# Altium project Node.PrjPcb
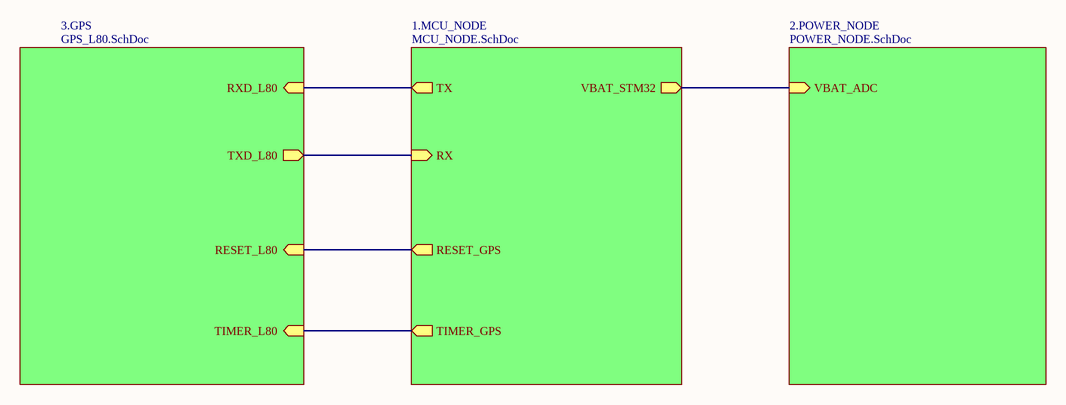
[diagram p0: Node.SchDoc]
4 sheets, 79 parts. Net scope: hierarchical (ports join the sheet entries above them; power ports are global).
Board file: NODE.PcbDoc
Sheets:
  Node.SchDoc
    1.MCU_NODE = MCU_NODE.SchDoc
    2.POWER_NODE = POWER_NODE.SchDoc
    3.GPS = GPS_L80.SchDoc

## Sheet Node.SchDoc
size A

### Sub-sheets
1.MCU_NODE = MCU_NODE.SchDoc: TX (out), VBAT_STM32 (out), RX (in), RESET_GPS (out), TIMER_GPS (out)
2.POWER_NODE = POWER_NODE.SchDoc: VBAT_ADC (in)
3.GPS = GPS_L80.SchDoc: RXD_L80 (in), TXD_L80 (out), RESET_L80 (in), TIMER_L80 (in)

### Nets
NetC23_2: sheet 1.MCU_NODE/VBAT_STM32, sheet 2.POWER_NODE/VBAT_ADC
NetR19_2: sheet 1.MCU_NODE/RESET_GPS, sheet 3.GPS/RESET_L80
NetU1_12: sheet 1.MCU_NODE/TX, sheet 3.GPS/RXD_L80
NetU1_13: sheet 1.MCU_NODE/RX, sheet 3.GPS/TXD_L80
NetU1_17: sheet 1.MCU_NODE/TIMER_GPS, sheet 3.GPS/TIMER_L80

## Sheet MCU_NODE.SchDoc
size A
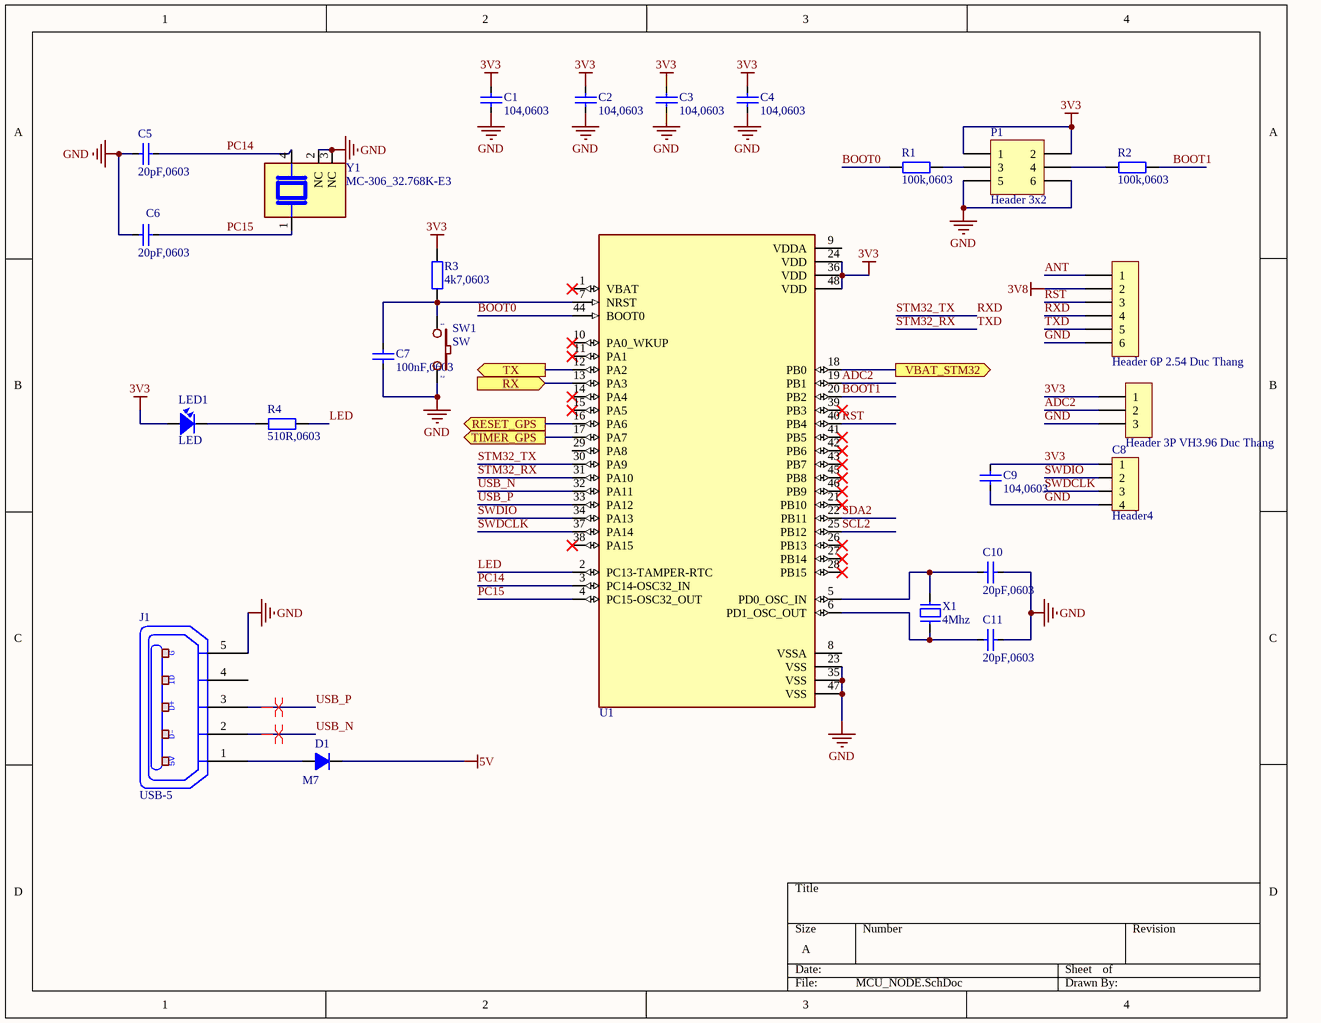
[diagram p1: MCU_NODE.SchDoc]

### Parts
C1  104,0603  [CAP_0603]
C2  104,0603  [CAP_0603]
C3  104,0603  [CAP_0603]
C4  104,0603  [CAP_0603]
C5  20pF,0603  [CAP_0603]
C6  20pF,0603  [CAP_0603]
C7  100nF,0603  [CAP_0603]
C8  Header4  [JP4-D1C]
C9  104,0603  [CAP_0603]
C10  20pF,0603  [CAP_0603]
C11  20pF,0603  [CAP_0603]
D1  M7  [SMA]
H1  Header 6P 2.54 Duc Thang  [XH2.54M-6]
H2  Header 3P VH3.96 Duc Thang  [VH3.96M-3]
J1  USB-5  [USB-M1]
LED1  LED  [LED-0805-Blue]
P1  Header 3x2  [Header 3x2]
R1  100k,0603  [RES-SMD-0603]
R2  100k,0603  [RES-SMD-0603]
R3  4k7,0603  [RES-SMD-0603]
R4  510R,0603  [RES-SMD-0603]
SW1  SW  [SW-SMD]
U1  STM32  [LQFP 48]  (value not drawn)
X1  4Mhz  [XT2]
Y1  MC-306_32.768K-E3  [XTAL_MC-306_32.768K-E3]

### Ports
RESET_GPS (out), RX (in), TIMER_GPS (out), TX (out), VBAT_STM32 (out)

### Nets
3V3: C1.2 C2.2 C3.2 C4.2 C8.1 C9.2 H2.1 LED1.1 P1.1 P1.2 R3.1 U1.24(VDD) U1.36(VDD) U1.48(VDD)
3V8: H1.2
5V: D1.2(K)
GND: C1.1 C2.1 C3.1 C4.1 C5.1 C6.1 C7.1 C8.4 C9.1 C10.2 C11.2 H1.6 H2.3 J1.5(P5) P1.5 P1.6 SW1.2 U1.23(VSS) U1.35(VSS) U1.47(VSS) Y1.2(NC) Y1.3(NC)
ADC2: H2.2 U1.19(PB1)
ANT: H1.1
BOOT0: R1.1 U1.44(BOOT0)
BOOT1: R2.2 U1.20(PB2)
LED: R4.2 U1.2(PC13-TAMPER-RTC)
PC14: C5.2 U1.3(PC14-OSC32_IN) Y1.4
PC15: C6.2 U1.4(PC15-OSC32_OUT) Y1.1
RST: H1.3 U1.40(PB4)
RXD: H1.4 U1.30(PA9)  [also labelled STM32_TX]
SCL2: U1.25(PB12)
SDA2: U1.22(PB11)
STM32_RX: H1.5 U1.31(PA10)  [also labelled TXD]
SWDCLK: C8.3 U1.37(PA14)
SWDIO: C8.2 U1.34(PA13)
USB_N: J1.2(P2) U1.32(PA11)
USB_P: J1.3(P3) U1.33(PA12)
NetC7_2: C7.2 R3.2 SW1.1 U1.7(NRST)
NetC10_1: C10.1 U1.5(PD0_OSC_IN) X1.2
NetC11_1: C11.1 U1.6(PD1_OSC_OUT) X1.1
NetC23_2: U1.18(PB0) ; port VBAT_STM32
NetD1_1: D1.1(A) J1.1(P1)
NetLED1_2: LED1.2 R4.1
NetP1_3: P1.3 R1.2
NetP1_4: P1.4 R2.1
NetR19_2: U1.16(PA6) ; port RESET_GPS
NetU1_12: U1.12(PA2) ; port TX
NetU1_13: U1.13(PA3) ; port RX
NetU1_17: U1.17(PA7) ; port TIMER_GPS

Not connected (* = marked no-connect by the designer): J1 4(P4); U1 1(VBAT)* 8(VSSA) 9(VDDA) 10(PA0_WKUP)* 11(PA1)* 14(PA4)* 15(PA5)* 21(PB10)* 26(PB13)* 27(PB14)* 28(PB15)* 29(PA8) 38(PA15)* 39(PB3)* 41(PB5)* 42(PB6)* 43(PB7)* 45(PB8)* 46(PB9)*

### Layout directives
differential pair: USB_N, USB_P

### Notes on the sheet
- (in symbol USB-5) G; ID; D+; D-; 5V

### Library data of the parts
C1-C7 C9-C11 = CapSMD: Capacitor; Value: 33p; Published: 8-Jun-2000; LatestRevisionDate: 17-Jul-2002; LatestRevisionNote: Re-released for DXP Platform.; PackageReference: RAD-0.3; Publisher: Altium Limited
C8 = Header4: Header IDC, 4 x 1 Pin Vertical 2.54mm Pitch (Non-Boxed, Male); Manufacturer: W¨¹rth Elektronik eiSos GmbH; partNo: 613002143121; ComponentLink1 Description: Manufacturer; ComponentLink2 Description: Datasheet; NoPins: 02; Created Date: 29 March 2013; ComponentLink1URL: http://www.we-online.com; ComponentLink2URL: http://katalog.we-online.de/em/datasheet/6130xx143121.pdf; Created by: Karrer Zheng
D1 = D1A: Diode 1A; Value: 1N4007
H1 = Header 6P 2.54 Duc Thang: Cắm; Ten_Linh_Kien: Header 6P XH2.54-6P Đực Thẳng; Don_Vi: Con; Ma_Hang: MH001972; Chung_Loai: Cắm
H2 = Header 3P VH3.96 Duc Thang: Cắm; Ten_Linh_Kien: Header 3P XH2.54-3P Đực Thẳng; Don_Vi: Con; Ma_Hang: MH001292; Chung_Loai: Cắm
J1 = USB-5: Manufacturer: FCI; Manufacturer Part Number: 10118193-0001LF; Connector Type: USB - micro B; Number of Contacts: 5; Gender: Receptacle; Specifications: USB 2.0; .Creator: MM; .Checked PCB: RF; Supplier 1: Digi-Key; RoHS: RoHS Compliant; Category: Connectors, Interconnects; Stock 1: 28642; Pricing 1: 1=0.46, 10=0.433, 25=0.3712, 50=0.3156, 100=0.3032, 250=0.27224, 500=0.25988 (USD); Packaging: Cut Tape (CT); Mounting Type: Surface Mount, Right Angle, Horizontal; Features: Shielded, Solder Retention; Ingress Protection: -; ComponentLink1URL: http://portal.fciconnect.com/Comergent//fci/drawing/10118193.pdf; ComponentLink1Description: http://portal.fciconnect.com/Comergent//fci/drawing/10118193.pdf; Supplier Part Number 1: 609-4616-1-ND; .Checked SCH: MM
LED1 = LED: LED Single colour Green and Red; Value: LED 3 ly Single Colour
P1 = Header 3x2: Header, 6-Pin, 2-Row; LatestRevisionDate: 17-Jul-2002; LatestRevisionNote: Re-released for DXP Platform.; Publisher: Altium Limited
R1-R4 = Resistor - SMD: Resistor SMD; Manufacturer: Generic Components; Class: Passive; Published: 08/06/2000; Publisher: Altium Hobart Technology Centre
SW1 = SW2: Switch button 2 pin; Value: SW chip 2 pin
U1 = STM32F103C8T6: STM32 ARM-based 32-bit MCU with 64 Kbytes Flash, 64-pin LQFP, Industrial Temperature
X1 = XT2: Crystal For all Crystal 2pin.; Value: 4Mhz
Y1 = MC-306_32.768K-E3: CRYSTAL 32.7680KHZ 6PF SMD; MF: EPSON; MP: MC-306 32.768K-E3; Check_prices: https://www.snapeda.com/parts/MC-306%2032.768K-E3/EPSON/view-part/?ref=eda; Package: NON STANDARD-4 EPSON; Value: *; Price: None; Purchase-URL: https://pricing.snapeda.com/search/part/MC-306 32.768K-E3/?ref=eda; SnapEDA_Link: https://www.snapeda.com/parts/MC-306%2032.768K-E3/EPSON/view-part/?ref=snap; Availability: In Stock

## Sheet POWER_NODE.SchDoc
size A
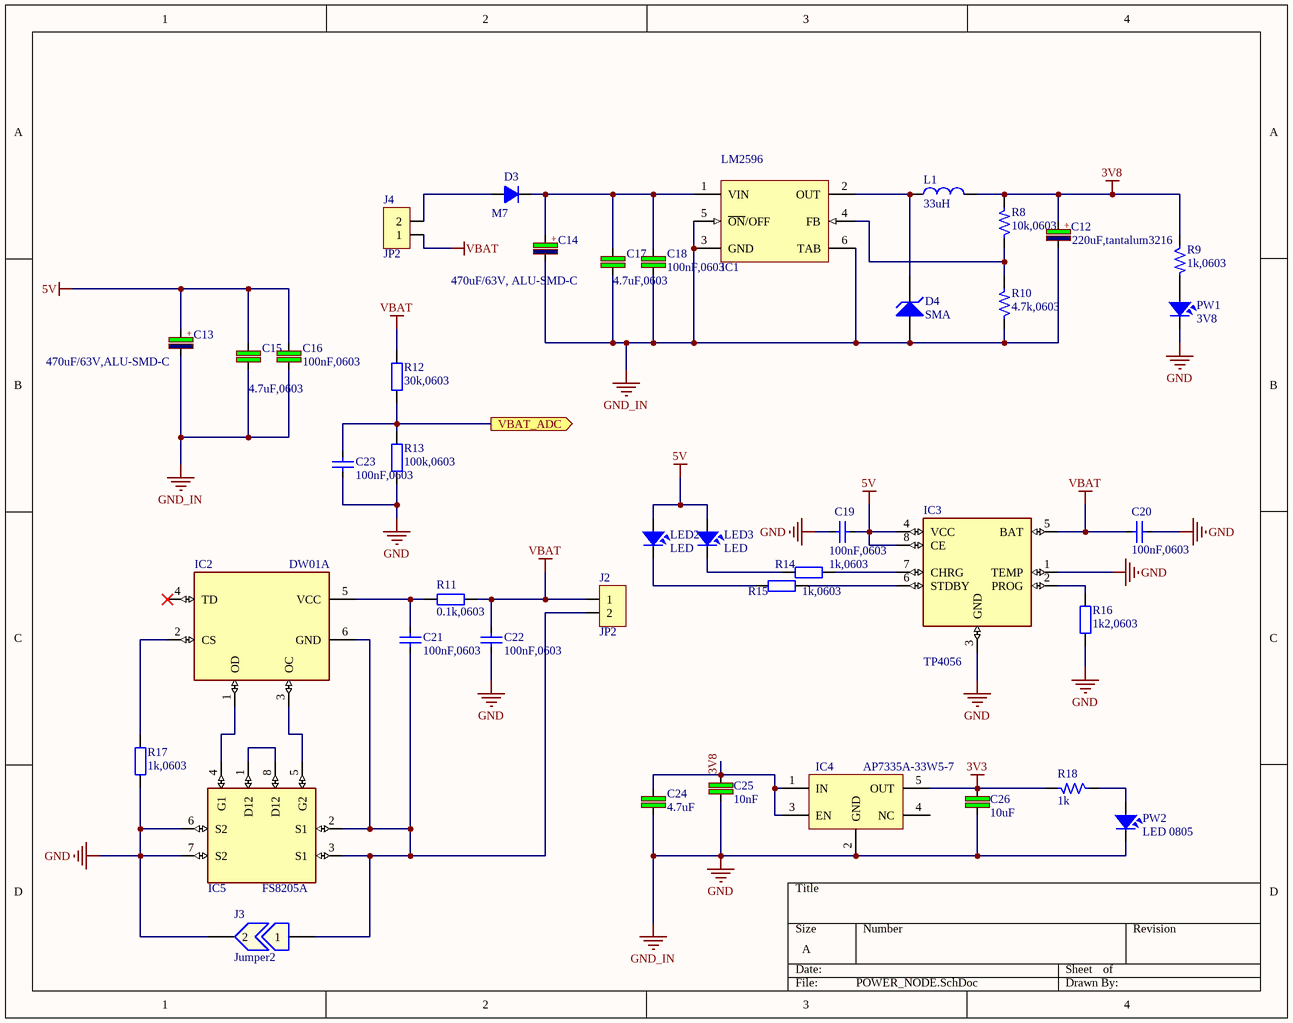
[diagram p2: POWER_NODE.SchDoc]

### Parts
C12  value 220uF,tantalum3216  [CAP_TANTALUM_3216]  (hidden comment: 220uF)
C13  470uF/63V,ALU-SMD-C  [CAP-ALU-SMD-C]
C14  470uF/63V, ALU-SMD-C  [CAP-ALU-SMD-C]
C15  value 4.7uF,0603  [CAP_0603]  (hidden comment: 4.7uF)
C16  value 100nF,0603  [CAP_0603]  (hidden comment: 4.7uF)
C17  value 4.7uF,0603  [CAP_0603]  (hidden comment: 4.7uF)
C18  value 100nF,0603  [CAP_0603]  (hidden comment: 4.7uF)
C19  100nF,0603  [CAP_0603]
C20  100nF,0603  [CAP_0603]
C21  100nF,0603  [CAP_0603]
C22  100nF,0603  [CAP_0603]
C23  100nF,0603  [CAP_0603]
C24  4.7uF  [CAP_0603]
C25  10nF  [CAP_0603]
C26  10uF  [CAP_0603]
D3  M7  [SMA]
D4  SMA  [SMA]
IC1  LM2596  [TO-263]
IC2  DW01A  [SOT23-6]
IC3  TP4056  [TP4056]
IC4  AP7335A-33W5-7  [SOT23-5]
IC5  FS8205A  [FS8205A]
J2  JP2  [KF2-5.08]
J3  Jumper2  [JUMPER2]
J4  JP2  [KF2-5.08]
L1  33uH  [Inductor_SMD]
LED2  LED  [LED-0805-Blue]
LED3  LED  [LED-0805-Blue]
PW1  3V8  [LED-0805-Blue]
PW2  LED 0805  [LED-0805-Blue]
R8  10k,0603  [RES-SMD-0603]
R9  1k,0603  [RES-SMD-0603]
R10  4.7k,0603  [RES-SMD-0603]
R11  0.1k,0603  [RES-SMD-0603]
R12  30k,0603  [RES-SMD-0603]
R13  100k,0603  [RES-SMD-0603]
R14  1k,0603  [RES-SMD-0603]
R15  1k,0603  [RES-SMD-0603]
R16  1k2,0603  [RES-SMD-0603]
R17  1k,0603  [RES-SMD-0603]
R18  1k  [RES-SMD-0603]

### Ports
VBAT_ADC (out)

### Nets
3V3: C26.1 IC4.5(OUT) R18.2
3V8: C12.1 C24.2 C25.1 IC4.1(IN) IC4.3(EN) L1.2 R8.2 R9.1
5V: C13.1 C15.2 C16.2 C19.1 IC3.4(VCC) IC3.8(CE) LED2.1 LED3.1
GND: C12.2 C13.2 C14.2 C15.1 C16.1 C17.1 C18.1 C19.2 C20.1 C22.1 C23.1 C24.1 C25.2 C26.2 D4.1(A) IC1.3(GND) IC1.5(~{ON}/OFF) IC1.6(TAB) IC3.1(TEMP) IC3.3(GND) IC4.2(GND) IC5.6(S2) IC5.7(S2) J3.2 PW1.2 PW2.2 R10.1 R13.1 R16.2 R17.2  [also labelled GND_IN]
VBAT: C20.2 C22.2 IC3.5(BAT) J2.1 J4.1 R11.2 R12.2
NetC14_1: C14.1 C17.2 C18.2 D3.2(K) IC1.1(VIN)
NetC21_1: C21.1 IC2.6(GND) IC5.2(S1) IC5.3(S1) J2.2 J3.1
NetC21_2: C21.2 IC2.5(VCC) R11.1
NetC23_2: C23.2 R12.1 R13.2 ; port VBAT_ADC
NetD3_1: D3.1(A) J4.2
NetD4_2: D4.2(K) IC1.2(OUT) L1.1
NetIC1_4: IC1.4(FB) R8.1 R10.2
NetIC2_1: IC2.1(OD) IC5.4(G1)
NetIC2_2: IC2.2(CS) R17.1
NetIC2_3: IC2.3(OC) IC5.5(G2)
NetIC3_2: IC3.2(PROG) R16.1
NetIC3_6: IC3.6(STDBY) R15.2
NetIC3_7: IC3.7(CHRG) R14.2
NetIC5_1: IC5.1(D12) IC5.8(D12)
NetLED2_2: LED2.2 R15.1
NetLED3_2: LED3.2 R14.1
NetPW1_1: PW1.1 R9.2
NetPW2_1: PW2.1 R18.1

Not connected (* = marked no-connect by the designer): IC2 4(TD)*; IC4 4(NC)

### Notes on the sheet
- (in symbol CP3) +
- (in symbol CP5) +

### Library data of the parts
C12 = CP5: 220µF Molded Tantalum Polymer Capacitor 16V 2917 (7343 Metric) 40mOhm @ 100kHz; Manufacturer: AVX Corporation; Part number: TCME227M016R0040E; User_Description: CAP TANT POLY 220UF 16V 2917; Category: CAPACITOR; Package: 2917
C13 C14 = CP3: Cap 470uF/63V; Value: Cap 470uF/63V
C15-C18 C24 = C: 4.7µF ±10% 35V Ceramic Capacitor X5R 0805 (2012 Metric); Manufacturer: Samsung Electro-Mechanics; Part number: CL21A475KLCLQNC; User_Description: CAP CER 4.7UF 35V X5R 0805; Category: CAPACITOR; Package: 0805
  C24: Value: 4.7uF
C19-C23 = CapSMD: Capacitor; Value: 33p; Published: 8-Jun-2000; LatestRevisionDate: 17-Jul-2002; LatestRevisionNote: Re-released for DXP Platform.; PackageReference: RAD-0.3; Publisher: Altium Limited
C25 = C: Cap SMD; Manufacturer: Samsung Electro-Mechanics; Part number: CL21A106KPFNNNG; Value: 10uF; User_Description: CAP CER 10UF 10V X5R 0805; Category: CAPACITOR; Package: 0805
C26 = C: Cap SMD; Manufacturer: Samsung Electro-Mechanics; Part number: CL21A106KPFNNNG; User_Description: CAP CER 10UF 10V X5R 0805; Value: 10uF; Category: CAPACITOR; Package: 0805
D3 = D1A: Diode 1A; Value: 1N4007
D4 = Diode Zener: Zener Diode; Published: 8-Jun-2000; LatestRevisionDate: 17-Jul-2002; LatestRevisionNote: Re-released for DXP Platform.; PackageReference: DIODE-0.7; Publisher: Altium Limited
IC1 = LM2576
IC2 = DW01A: One Cell Lithium-ion/Polymer Battery Protection IC
IC3 = TP4056: Complete single cell Li-Ion battery with a constant current / constant voltage linear charger
J2 J4 = JP2: WR-PHD 2.54 mm Angled Socket Header; Manufacturer: W¨¹rth Elektronik eiSos GmbH; partNo: 613002143121; ComponentLink1 Description: Manufacturer; ComponentLink2 Description: Datasheet; NoPins: 02; Created Date: 29 March 2013; ComponentLink1URL: http://www.we-online.com; ComponentLink2URL: http://katalog.we-online.de/em/datasheet/6130xx143121.pdf; Created by: Karrer Zheng
J3 = Jumper2: Jumper, 2-Pin
L1 = L1: 22µH Shielded Inductor 1.65A 96mOhm Max Nonstandard; Manufacturer: Bourns Inc.; Part Number: SRR0745A-220M; Value: 220uH; User_Description: FIXED IND 22UH 1.65A 96 MOHM SMD; Category: INDUCTORS; Package: SMD
LED2 LED3 = LED: as LED1 on sheet MCU_NODE
PW1 PW2 = LED: LED RED DIFFUSED 0805 SMD; Manufacturer: OSRAM Opto Semiconductors Inc.; Part number: LS R976-NR-1; Value: Red; Category: LED SMD; Package: 0805; User_Description: LED RED DIFFUSED 0805 SMD
R8 = R: RES SMD 10K OHM 1% 1/8W 0805; Manufacturer: Yageo; Part number: RC0805FR-0710KL; Category: RESISTORS; Package: 0805; User_Description: RES SMD 10K OHM 1% 1/8W 0805; Value: 10k
R9 R18 = R: Resistor 1/4W; Manufacturer: Yageo; Part number: RC0805FR-071KL; User_Description: RES SMD 1K OHM 1% 1/8W 0805; Value: 1k; Category: RESISTORS; Package: 0805
R10 = R: RES SMD 3.3K OHM 1% 1/8W 0805; Manufacturer: Yageo; Part number: RC0805FR-073K3L; Category: RESISTORS; Package: 0805; User_Description: RES SMD 3.3K OHM 1% 1/8W 0805; Value: 3.3k
R11-R17 = Resistor - SMD: as R1 on sheet MCU_NODE; Published: 08/06/2000; Publisher: Altium Hobart Technology Centre
IC4 = AP7335A-33W5-7: Package: SOT23-5; Part number: AP7335A-33W5-7

## Sheet GPS_L80.SchDoc
size A
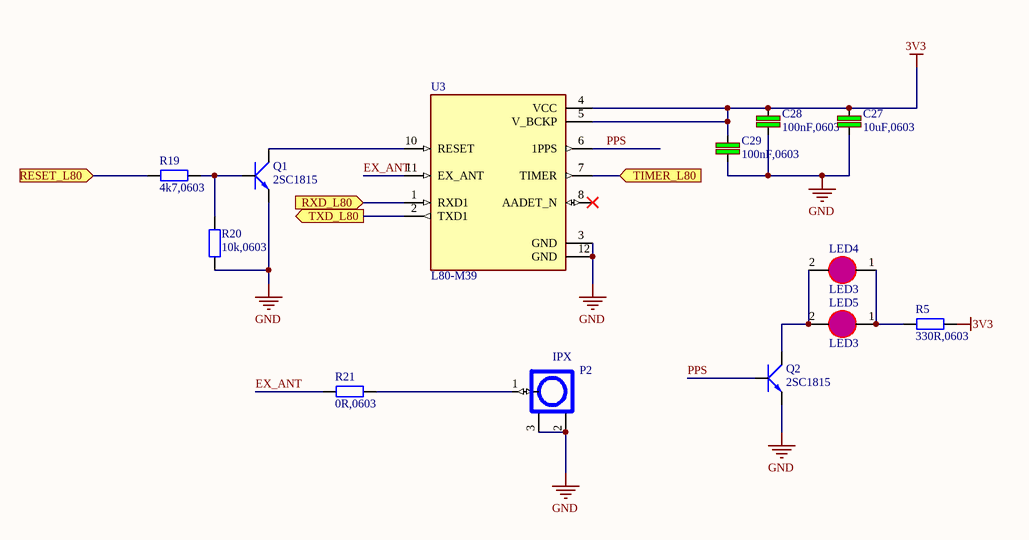
[diagram p3: GPS_L80.SchDoc]

### Parts
C27  value 10uF,0603  [CAP_0603]  (hidden comment: 4.7uF)
C28  value 100nF,0603  [CAP_0603]  (hidden comment: 4.7uF)
C29  value 100nF,0603  [CAP_0603]  (hidden comment: 4.7uF)
LED4  LED3  [LED0805]
LED5  LED3  [LED0805]
P2  IPX  [IPXS]
Q1  2SC1815  [SOT23]
Q2  2SC1815  [SOT23-321]
R5  330R,0603  [RES-SMD-0603]
R19  4k7,0603  [RES-SMD-0603]
R20  10k,0603  [RES-SMD-0603]
R21  0R,0603  [RES-SMD-0603]
U3  L80-M39  [XCVR_L80-M39]

### Ports
RESET_L80 (in), RXD_L80 (in), TIMER_L80 (in), TXD_L80 (out)

### Nets
3V3: C27.2 C28.2 C29.2 R5.1 U3.4(VCC) U3.5(V_BCKP)
GND: C27.1 C28.1 C29.1 P2.2 P2.3 Q1.1(E) Q2.1(E) R20.1 U3.3(GND) U3.12(GND)
EX_ANT: R21.2 U3.11(EX_ANT)
PPS: Q2.3(B) U3.6(1PPS)
NetLED4_1: LED4.1(A) LED5.1(A) R5.2
NetLED4_2: LED4.2(K) LED5.2(K) Q2.2(C)
NetP2_1: P2.1 R21.1
NetQ1_2: Q1.2(C) U3.10(RESET)
NetQ1_3: Q1.3(B) R19.1 R20.2
NetR19_2: R19.2 ; port RESET_L80
NetU1_12: U3.1(RXD1) ; port RXD_L80
NetU1_13: U3.2(TXD1) ; port TXD_L80
NetU1_17: U3.7(TIMER) ; port TIMER_L80

Not connected (* = marked no-connect by the designer): U3 8(AADET_N)*

### Library data of the parts
C27-C29 = C: as C15 on sheet POWER_NODE; Category: CAPACITOR; Package: 0805
LED4 LED5 = LED0805: LED SMD 0805
P2 = IPXSx66: Antenna GSM GPS; Manufacturer: TE Connectivity AMP Connectors; Part number: 2334884-1; User_Description: UMCC MICRO-COAX RECEPTACLE, GEN; Category: Connectors; Package: SMD
Q1 Q2 = 2SC1815: NPN 600mW, ECB; Value: C1815
R5 R19-R21 = Resistor - SMD: as R1 on sheet MCU_NODE; Published: 08/06/2000; Publisher: Altium Hobart Technology Centre
U3 = L80-M39: L80 is an ultra compact GPS POT (Patch on Top) module with an embedded 15.0mm Ã— 15.0mm Ã— 4.0mm patch antenna.; MF: Quectel; Check_prices: https://www.snapeda.com/parts/L80-M39/Quectel/view-part/51186/?ref=eda; Price: None; Package: None; Purchase-URL: https://pricing.snapeda.com/search/part/L80-M39/?ref=eda; Value: *; MP: L80-M39; SnapEDA_Link: https://www.snapeda.com/parts/L80-M39/Quectel/view-part/51186/?ref=snap; Availability: Warning

## Nets that join several sheets
3V3: MCU_NODE (14 pins), POWER_NODE (C26.1 IC4.5 R18.2), GPS_L80 (6 pins)
3V8: MCU_NODE (H1.2), POWER_NODE (8 pins)
5V: MCU_NODE (D1.2), POWER_NODE (8 pins)
GND: MCU_NODE (22 pins), POWER_NODE (30 pins), GPS_L80 (10 pins)
NetC23_2: MCU_NODE (U1.18), POWER_NODE (C23.2 R12.1 R13.2)
NetR19_2: MCU_NODE (U1.16), GPS_L80 (R19.2)
NetU1_12: MCU_NODE (U1.12), GPS_L80 (U3.1)
NetU1_13: MCU_NODE (U1.13), GPS_L80 (U3.2)
NetU1_17: MCU_NODE (U1.17), GPS_L80 (U3.7)